# Altium project NeoIVClock.PrjPcb
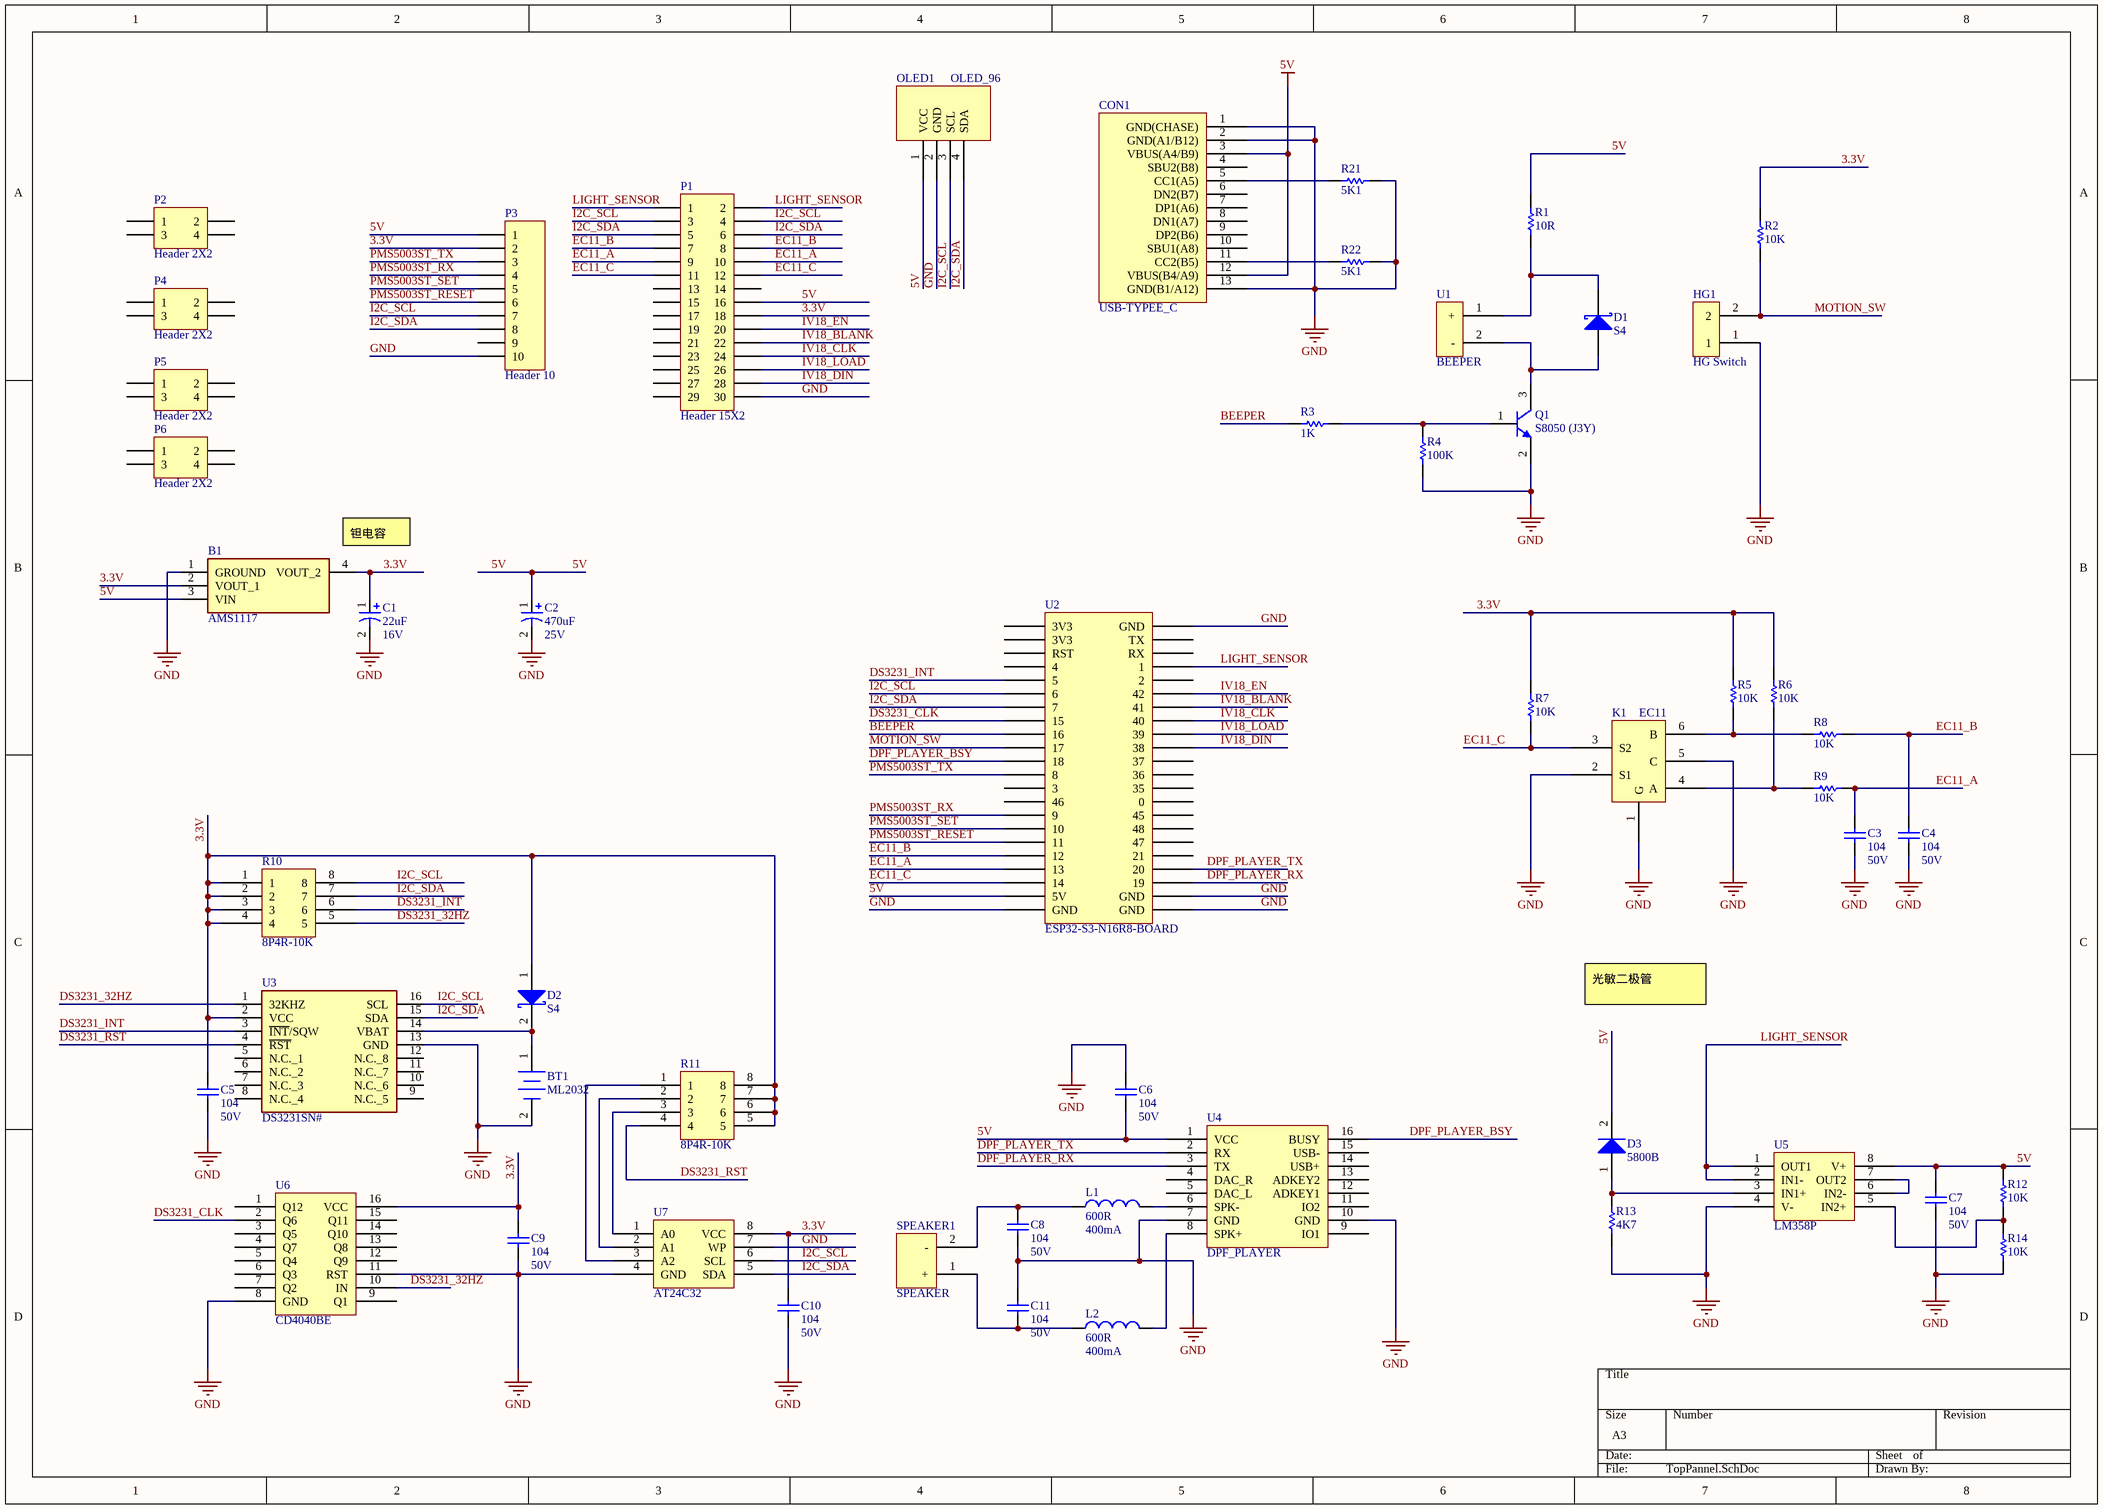
[diagram p0: TopPannel.SchDoc]
3 sheets, 87 parts. Net scope: global (net labels, ports and power ports of the same name join across sheets).
Board file: NeoIVClock.PcbDoc
Sheets:
  TopPannel.SchDoc
  RightPannel.SchDoc
  BottomPanel.SchDoc

## Sheet TopPannel.SchDoc
size A3; SheetNumber: 1; SheetTotal: 3

### Parts
B1  AMS1117  [SOT229P700X180-4N]
BT1  ML2032  [BAT2025-2032-L]
C1  16V  value 22uF  [TC3216-1206]
C2  25V  value 470uF  [SMD-EC-F10]
C3  50V  value 104  [CAPC1608L]
C4  50V  value 104  [CAPC1608L]
C5  50V  value 104  [CAPC1608L]
C6  50V  value 104  [CAPC1608L]
C7  50V  value 104  [CAPC1608L]
C8  50V  value 104  [CAPC1608L]
C9  50V  value 104  [CAPC1608L]
C10  50V  value 104  [CAPC1608L]
C11  50V  value 104  [CAPC1608L]
CON1  USB-TYPEE_C  [USB-TYPE_C]
D1  S4  [CD3216-1206]
D2  S4  [CD3216-1206]
D3  5800B  [5800B]
HG1  HG Switch  [HG]
K1  EC11  [EC11]
L1  400mA  value 600R  [CAPC2012L]
L2  400mA  value 600R  [CAPC2012L]
OLED1  OLED_96  [OLED_96]
P1  Header 15X2  [HDR2X15]
P2  Header 2X2  [HDR2X2]
P3  Header 10  [XH254-W-10P]
P4  Header 2X2  [HDR2X2]
P5  Header 2X2  [HDR2X2]
P6  Header 2X2  [HDR2X2]
Q1  S8050 (J3Y)  [SOT-23B_L]
R1  value 10R  [RESC1608L]  (hidden comment: Res1)
R2  value 10K  [RESC1608L]  (hidden comment: Res1)
R3  value 1K  [RESC1608L]  (hidden comment: Res1)
R4  value 100K  [RESC1608L]  (hidden comment: Res1)
R5  value 10K  [RESC1608L]  (hidden comment: Res1)
R6  value 10K  [RESC1608L]  (hidden comment: Res1)
R7  value 10K  [RESC1608L]  (hidden comment: Res1)
R8  value 10K  [RESC1608L]  (hidden comment: Res1)
R9  value 10K  [RESC1608L]  (hidden comment: Res1)
R10  8P4R-10K  [8P4R 0603]
R11  8P4R-10K  [8P4R 0603]
R12  value 10K  [RESC1608L]  (hidden comment: Res1)
R13  value 4K7  [RESC1608L]  (hidden comment: Res1)
R14  value 10K  [RESC1608L]  (hidden comment: Res1)
R21  value 5K1  [RESC1608L]  (hidden comment: Res1)
R22  value 5K1  [RESC1608L]  (hidden comment: Res1)
SPEAKER1  SPEAKER  [SPEAKER]
U1  BEEPER  [BEEPER]
U2  ESP32-S3-N16R8-BOARD  [ESP32-S3-N16R8-BOARD]
U3  DS3231SN#  [SOIC127P1032X265-16N]
U4  DPF_PLAYER  [DPF_PLAYER]
U5  LM358P  [DIP-8]
U6  CD4040BE  [DIP-16]
U7  AT24C32  [DIP-8]

### Nets
5V: B1.3(VIN) C2.1 C6.1 C7.2 CON1.3(VBUS(A4/B9)) CON1.12(VBUS(B4/A9)) D3.2(K) OLED1.1(VCC) P1.16 P3.1 R1.1 R12.1 U2.21(5V) U4.1(VCC) U5.8(V+)
GND: B1.1(GROUND) BT1.2(-) C1.2 C2.2 C3.1 C4.1 C5.1 C6.2 C7.1 C8.1 C9.1 C10.1 C11.2 CON1.1(GND(CHASE)) CON1.2(GND(A1/B12)) CON1.13(GND(B1/A12)) HG1.1 K1.1(G) K1.2(S1) K1.5(C) OLED1.2(GND) P1.30 P3.10 Q1.2(E) R4.2 R13.2 R14.2 R21.2 R22.2 U2.22(GND) U2.23(GND) U2.24(GND) U2.44(GND) U3.13(GND) U4.7(GND) U4.10(GND) U5.4(V-) U6.8(GND) U6.11(RST) U7.4(GND) U7.7(WP)
3.3V: B1.2(VOUT_1) B1.4(VOUT_2) C1.1 C5.2 C9.2 C10.2 D2.1(A) P1.18 P3.2 R2.1 R5.1 R6.1 R7.1 R10.1 R10.2 R10.3 R10.4 R11.5 R11.6 R11.7 R11.8 U3.2(VCC) U6.16(VCC) U7.8(VCC)
BEEPER: R3.1 U2.9(16)
DPF_PLAYER_BSY: U2.11(18) U4.16(BUSY)
DPF_PLAYER_RX: U2.25(19) U4.3(TX)
DPF_PLAYER_TX: U2.26(20) U4.2(RX)
DS3231_32HZ: R10.5 U3.1(32KHZ) U6.10(IN)
DS3231_CLK: U2.8(15) U6.2(Q6)
DS3231_INT: R10.6 U2.5 U3.3(~{INT}/SQW)
DS3231_RST: R11.4 U3.4(~{RST})
EC11_A: C3.2 P1.9 P1.10 R9.2 U2.19(13)
EC11_B: C4.2 P1.7 P1.8 R8.2 U2.18(12)
EC11_C: K1.3(S2) P1.11 P1.12 R7.2 U2.20(14)
I2C_SCL: OLED1.3(SCL) P1.3 P1.4 P3.7 R10.8 U2.6 U3.16(SCL) U7.6(SCL)
I2C_SDA: OLED1.4(SDA) P1.5 P1.6 P3.8 R10.7 U2.7 U3.15(SDA) U7.5(SDA)
IV18_BLANK: P1.22 U2.38(41)
IV18_CLK: P1.24 U2.37(40)
IV18_DIN: P1.28 U2.35(38)
IV18_EN: P1.20 U2.39(42)
IV18_LOAD: P1.26 U2.36(39)
LIGHT_SENSOR: P1.1 P1.2 U2.41(1) U5.1(OUT1) U5.2(IN1-)
MOTION_SW: HG1.2 R2.2 U2.10(17)
PMS5003ST_RESET: P3.6 U2.17(11)
PMS5003ST_RX: P3.4 U2.15(9)
PMS5003ST_SET: P3.5 U2.16(10)
PMS5003ST_TX: P3.3 U2.12(8)
NetBT1_1: BT1.1(+) D2.2(K) U3.14(VBAT)
NetC8_2: C8.2 L1.1 SPEAKER1.2(-)
NetC11_1: C11.1 L2.1 SPEAKER1.1(+)
NetCON1_5: CON1.5(CC1(A5)) R21.1
NetCON1_11: CON1.11(CC2(B5)) R22.1
NetD1_1: D1.1(A) Q1.3(C) U1.2(-)
NetD1_2: D1.2(K) R1.2 U1.1(+)
NetD3_1: D3.1(A) R13.1 U5.3(IN1+)
NetK1_4: K1.4(A) R6.2 R9.1
NetK1_6: K1.6(B) R5.2 R8.1
NetL1_2: L1.2 U4.6(SPK-)
NetL2_2: L2.2 U4.8(SPK+)
NetQ1_1: Q1.1(B) R3.2 R4.1
NetR11_1: R11.1 U7.3(A2)
NetR11_2: R11.2 U7.2(A1)
NetR11_3: R11.3 U7.1(A0)
NetR12_2: R12.2 R14.1 U5.5(IN2+)
NetU5_6: U5.6(IN2-) U5.7(OUT2)

Not connected (* = marked no-connect by the designer): CON1 4(SBU2(B8)) 6(DN2(B7)) 7(DP1(A6)) 8(DN1(A7)) 9(DP2(B6)) 10(SBU1(A8)); P1 13 14 15 17 19 21 23 25 27 29; P2 1 2 3 4; P3 9; P4 1 2 3 4; P5 1 2 3 4; P6 1 2 3 4; U2 1(3V3) 2(3V3) 3(RST) 4 13(3) 14(46) 27(21) 28(47) 29(48) 30(45) 31(0) 32(35) 33(36) 34(37) 40(2) 42(RX) 43(TX); U3 5(N.C._1) 6(N.C._2) 7(N.C._3) 8(N.C._4) 9(N.C._5) 10(N.C._6) 11(N.C._7) 12(N.C._8); U4 4(DAC_R) 5(DAC_L) 9(IO1) 11(IO2) 12(ADKEY1) 13(ADKEY2) 14(USB+) 15(USB-); U6 1(Q12) 3(Q5) 4(Q7) 5(Q4) 6(Q3) 7(Q2) 9(Q1) 12(Q9) 13(Q8) 14(Q10) 15(Q11)

### Notes on the sheet
- (near B1) 钽电容
- 光敏二极管

### Library data of the parts
B1 = AMS1117: 1117; Manufacturer_Name: Advanced Monolithic Systems; Geometry.Height: 1.8mm; Manufacturer_Part_Number: AMS1117; Mouser Part Number: *; Mouser Price/Stock: *; Arrow Part Number: *; Arrow Price/Stock: *; Datasheet Link: https://datasheet.lcsc.com/szlcsc/Advanced-Monolithic-Systems-AMS-AMS1117-ADJ_C6188.pdf
BT1 = Battery: Multicell Battery; Published: 24-Mar-1999; LatestRevisionDate: 17-Jul-2002; LatestRevisionNote: Re-released for DXP Platform.; PackageReference: BAT-2; Publisher: Altium Limited; PackageDescription: Battery; 2 Leads
C1 C2 = Cap Pol1: Polarized Capacitor (Radial); Published: 8-Jun-2000; LatestRevisionDate: 17-Jul-2002; LatestRevisionNote: Re-released for DXP Platform.; PackageReference: RB7.6-15; Publisher: Altium Limited; PackageDescription: Polarized Capacitor (Radial); 2 Leads
C3-C11 = Cap: Capacitor; Published: 8-Jun-2000; LatestRevisionDate: 17-Jul-2002; LatestRevisionNote: Re-released for DXP Platform.; PackageReference: RAD-0.3; Publisher: Altium Limited; PackageDescription: Radial Cap, Thru-Hole; 2 Leads; 0.3 in Pin Spacing
D1 D2 = D Schottky: Schottky Diode; Published: 8-Jun-2000; LatestRevisionDate: 17-Jul-2002; LatestRevisionNote: Re-released for DXP Platform.; PackageReference: SMB; Publisher: Altium Limited; PackageDescription: DO-214-AA/SMB; 2 C-Bend Leads; Body 5.3 x 3.6 mm, inc. leads (LxW); Code_JEDEC: DO-214-AA
D3 = Diode: Default Diode; Published: 8-Jun-2000; LatestRevisionDate: 17-Jul-2002; LatestRevisionNote: Re-released for DXP Platform.; PackageVersion: Sep-1996; PackageReference: SMC; Publisher: Altium Limited; PackageDescription: DO-214-AB/SMC; 2 C-Bend Leads; Body 7.9 x 5.9 mm, inc. leads (LxW); Code_JEDEC: DO-214-AB
HG1 = HG
L1 L2 = Inductor: Code_IEC: 1005; Published: 8-Jun-2000; LatestRevisionDate: 29-May-2009; LatestRevisionNote: IPC-7351 Footprint Added.; PackageReference: 0402-A; Publisher: Altium Limited; PackageDescription: Chip Inductor; Code_JEITA: 0402
P1 = Header 15X2: Header, 15-Pin, Dual row; LatestRevisionDate: 17-Jul-2002; LatestRevisionNote: Re-released for DXP Platform.; Publisher: Altium Limited
P2 P4-P6 = Header 2X2: Header, 2-Pin, Dual row; LatestRevisionDate: 17-Jul-2002; LatestRevisionNote: Re-released for DXP Platform.; Publisher: Altium Limited
P3 = Header 10: Header, 10-Pin; LatestRevisionDate: 17-Jul-2002; LatestRevisionNote: Re-released for DXP Platform.; Publisher: Altium Limited
Q1 = NPN: NPN Bipolar Transistor; Published: 8-Jun-2000; LatestRevisionDate: 17-Jul-2002; LatestRevisionNote: Re-released for DXP Platform.; PackageReference: TO-226-AA; Publisher: Altium Limited; PackageDescription: TO, Flat Index; 3 In-Line, Axial Leads; Body Dia. 4.8mm; Leads 0.55 x 0.51 mm (max); Code_JEDEC: TO-226-AA
R1-R9 R12-R14 R21 R22 = Res1: Resistor; Published: 8-Jun-2000; LatestRevisionDate: 17-Jul-2002; LatestRevisionNote: Re-released for DXP Platform.; PackageReference: AXIAL-0.3; Publisher: Altium Limited; PackageDescription: Axial Device, Thru-Hole; 2 Leads; 0.3 in Pin Spacing
R10 R11 = 8P4R
U3 = DS3231SN#: Real Time Clock Serial Maxim DS3231SN# Real Time Clock, Battery Backup, Calendar, Clock, I2C, 5.5 V, 16-Pin SOIC; Manufacturer_Name: Analog Devices; Geometry.Height: 2.65mm; Manufacturer_Part_Number: DS3231SN#; Mouser Part Number: 700-DS3231SN#; Mouser Price/Stock: https://www.mouser.co.uk/ProductDetail/Analog-Devices-Maxim-Integrated/DS3231SN?qs=1eQvB6Dk1vhUlr8%2FOrV0Fw%3D%3D; Arrow Part Number: DS3231SN#; Arrow Price/Stock: https://www.arrow.com/en/products/ds3231sn_2/analog-devices.html?utm_currency=USD&region=nac; Datasheet Link: https://datasheets.maximintegrated.com/en/ds/DS3231.pdf

## Sheet RightPannel.SchDoc
size A4; SheetNumber: 2; SheetTotal: 3
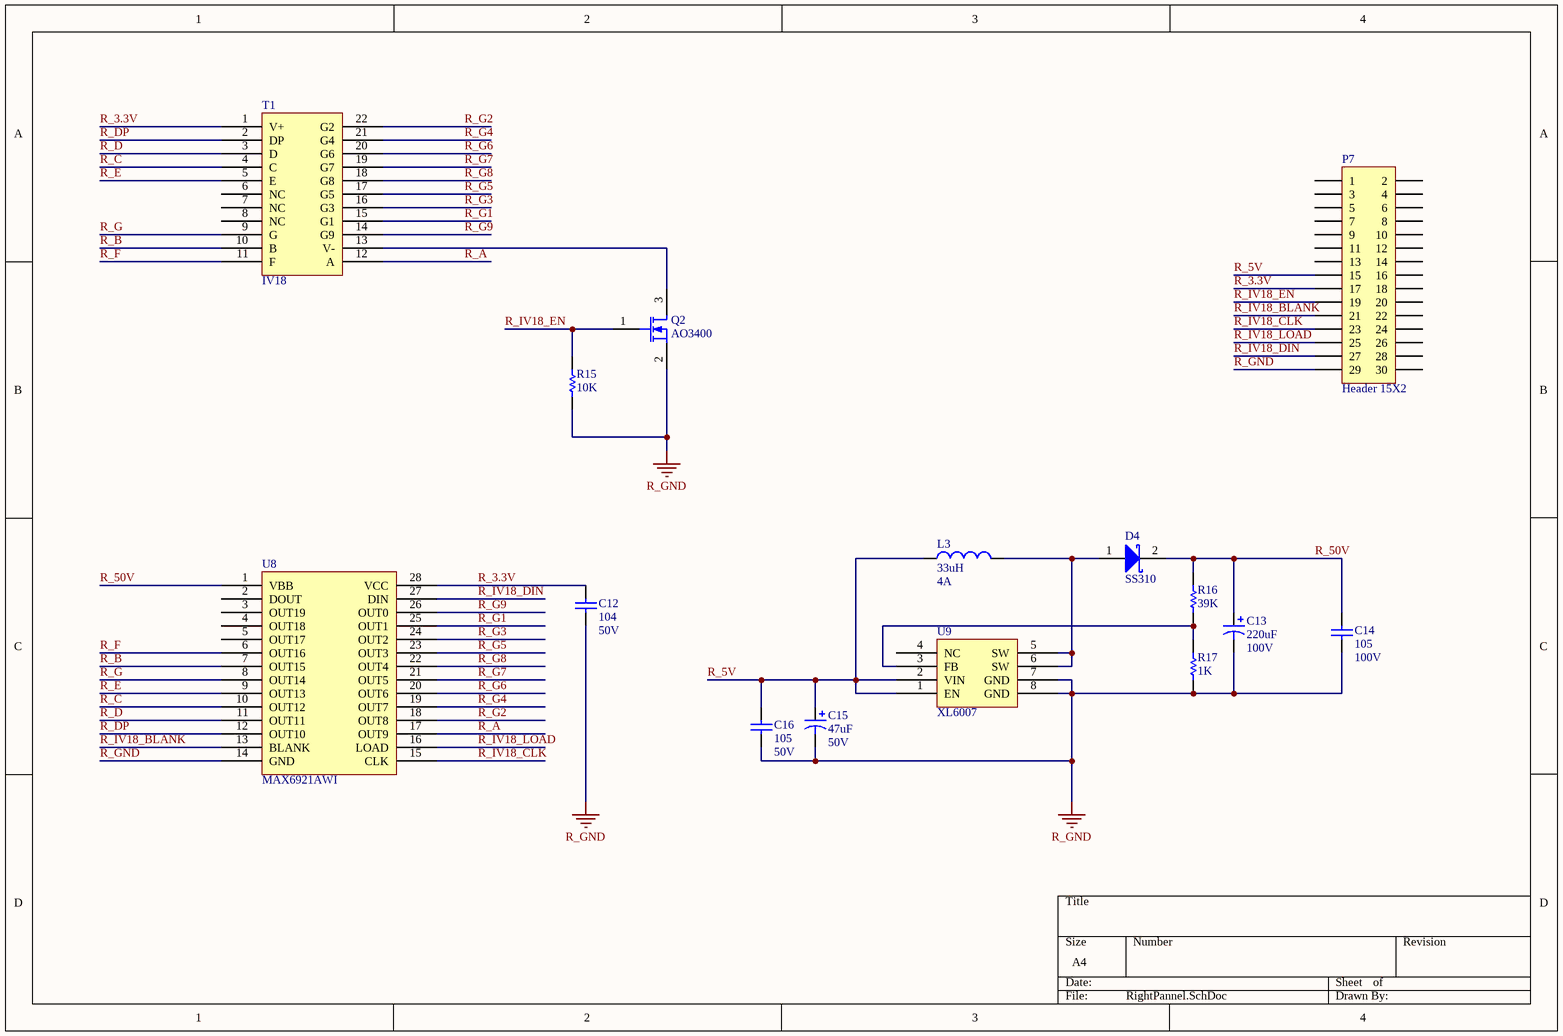
[diagram p1: RightPannel.SchDoc]

### Parts
C12  50V  value 104  [CAPC1608L]
C13  100V  value 220uF  [SMD-EC-F16]
C14  100V  value 105  [CAPC2012L]
C15  50V  value 47uF  [SMD-EC-F6.3]
C16  50V  value 105  [CAPC1608L]
D4  SS310  [DO-214AC-SMA]
L3  4A  value 33uH  [CYH125]
P7  Header 15X2  [HDR2X15]
Q2  AO3400  [SOT-23B_L]
R15  value 10K  [RESC1608L]  (hidden comment: Res1)
R16  value 39K  [RESC1608L]  (hidden comment: Res1)
R17  value 1K  [RESC1608L]  (hidden comment: Res1)
T1  IV18  [IV18]
U8  MAX6921AWI  [SOIC127P1032X265-28N]
U9  XL6007  [SOP127P780-8L]

### Nets
R_GND: C12.1 C13.2 C14.1 C15.2 C16.1 P7.29 Q2.2(S) R15.2 R17.2 U8.14(GND) U9.7(GND) U9.8(GND)
R_3.3V: C12.2 P7.17 T1.1(V+) U8.28(VCC)
R_5V: C15.1 C16.2 L3.1 P7.15 U9.1(EN) U9.2(VIN)
R_50V: C13.1 C14.2 D4.2(K) R16.1 U8.1(VBB)
R_A: T1.12(A) U8.17(OUT9)
R_B: T1.10(B) U8.7(OUT15)
R_C: T1.4(C) U8.10(OUT12)
R_D: T1.3(D) U8.11(OUT11)
R_DP: T1.2(DP) U8.12(OUT10)
R_E: T1.5(E) U8.9(OUT13)
R_F: T1.11(F) U8.6(OUT16)
R_G: T1.9(G) U8.8(OUT14)
R_G1: T1.15(G1) U8.25(OUT1)
R_G2: T1.22(G2) U8.18(OUT8)
R_G3: T1.16(G3) U8.24(OUT2)
R_G4: T1.21(G4) U8.19(OUT7)
R_G5: T1.17(G5) U8.23(OUT3)
R_G6: T1.20(G6) U8.20(OUT6)
R_G7: T1.19(G7) U8.21(OUT5)
R_G8: T1.18(G8) U8.22(OUT4)
R_G9: T1.14(G9) U8.26(OUT0)
R_IV18_BLANK: P7.21 U8.13(BLANK)
R_IV18_CLK: P7.23 U8.15(CLK)
R_IV18_DIN: P7.27 U8.27(DIN)
R_IV18_EN: P7.19 Q2.1(G) R15.1
R_IV18_LOAD: P7.25 U8.16(LOAD)
NetD4_1: D4.1(A) L3.2 U9.5(SW) U9.6(SW)
NetQ2_3: Q2.3(D) T1.13(V-)
NetR16_2: R16.2 R17.1 U9.3(FB)

Not connected (* = marked no-connect by the designer): P7 1 2 3 4 5 6 7 8 9 10 11 12 13 14 16 18 20 22 24 26 28 30; T1 6(NC) 7(NC) 8(NC); U8 2(DOUT) 3(OUT19) 4(OUT18) 5(OUT17); U9 4(NC)

### Library data of the parts
C12 C14 C16 = Cap: Capacitor; Published: 8-Jun-2000; LatestRevisionDate: 17-Jul-2002; LatestRevisionNote: Re-released for DXP Platform.; PackageReference: RAD-0.3; Publisher: Altium Limited; PackageDescription: Radial Cap, Thru-Hole; 2 Leads; 0.3 in Pin Spacing
C13 C15 = Cap Pol1: Polarized Capacitor (Radial); Published: 8-Jun-2000; LatestRevisionDate: 17-Jul-2002; LatestRevisionNote: Re-released for DXP Platform.; PackageReference: RB7.6-15; Publisher: Altium Limited; PackageDescription: Polarized Capacitor (Radial); 2 Leads
D4 = D Schottky: Schottky Diode; Published: 8-Jun-2000; LatestRevisionDate: 17-Jul-2002; LatestRevisionNote: Re-released for DXP Platform.; PackageReference: SMB; Publisher: Altium Limited; PackageDescription: DO-214-AA/SMB; 2 C-Bend Leads; Body 5.3 x 3.6 mm, inc. leads (LxW); Code_JEDEC: DO-214-AA
L3 = Inductor: Code_IEC: 1005; Published: 8-Jun-2000; LatestRevisionDate: 29-May-2009; LatestRevisionNote: IPC-7351 Footprint Added.; PackageReference: 0402-A; Publisher: Altium Limited; PackageDescription: Chip Inductor; Code_JEITA: 0402
P7 = Header 15X2: Header, 15-Pin, Dual row; LatestRevisionDate: 17-Jul-2002; LatestRevisionNote: Re-released for DXP Platform.; Publisher: Altium Limited
Q2 = MOSFET-N: N-Channel MOSFET; Published: 8-Jun-2000; LatestRevisionDate: 17-Jul-2002; LatestRevisionNote: Re-released for DXP Platform.; PackageVersion: 1995/1996; PackageReference: E3; Publisher: Altium Limited; PackageDescription: TO, Flat Index; 3 In-Line, Axial Leads; Body Dia. 4.6mm; Lead Dia. 0.5 mm (max)
R15-R17 = Res1: Resistor; Published: 8-Jun-2000; LatestRevisionDate: 17-Jul-2002; LatestRevisionNote: Re-released for DXP Platform.; PackageReference: AXIAL-0.3; Publisher: Altium Limited; PackageDescription: Axial Device, Thru-Hole; 2 Leads; 0.3 in Pin Spacing

## Sheet BottomPanel.SchDoc
size A3; SheetNumber: 3; SheetTotal: 3
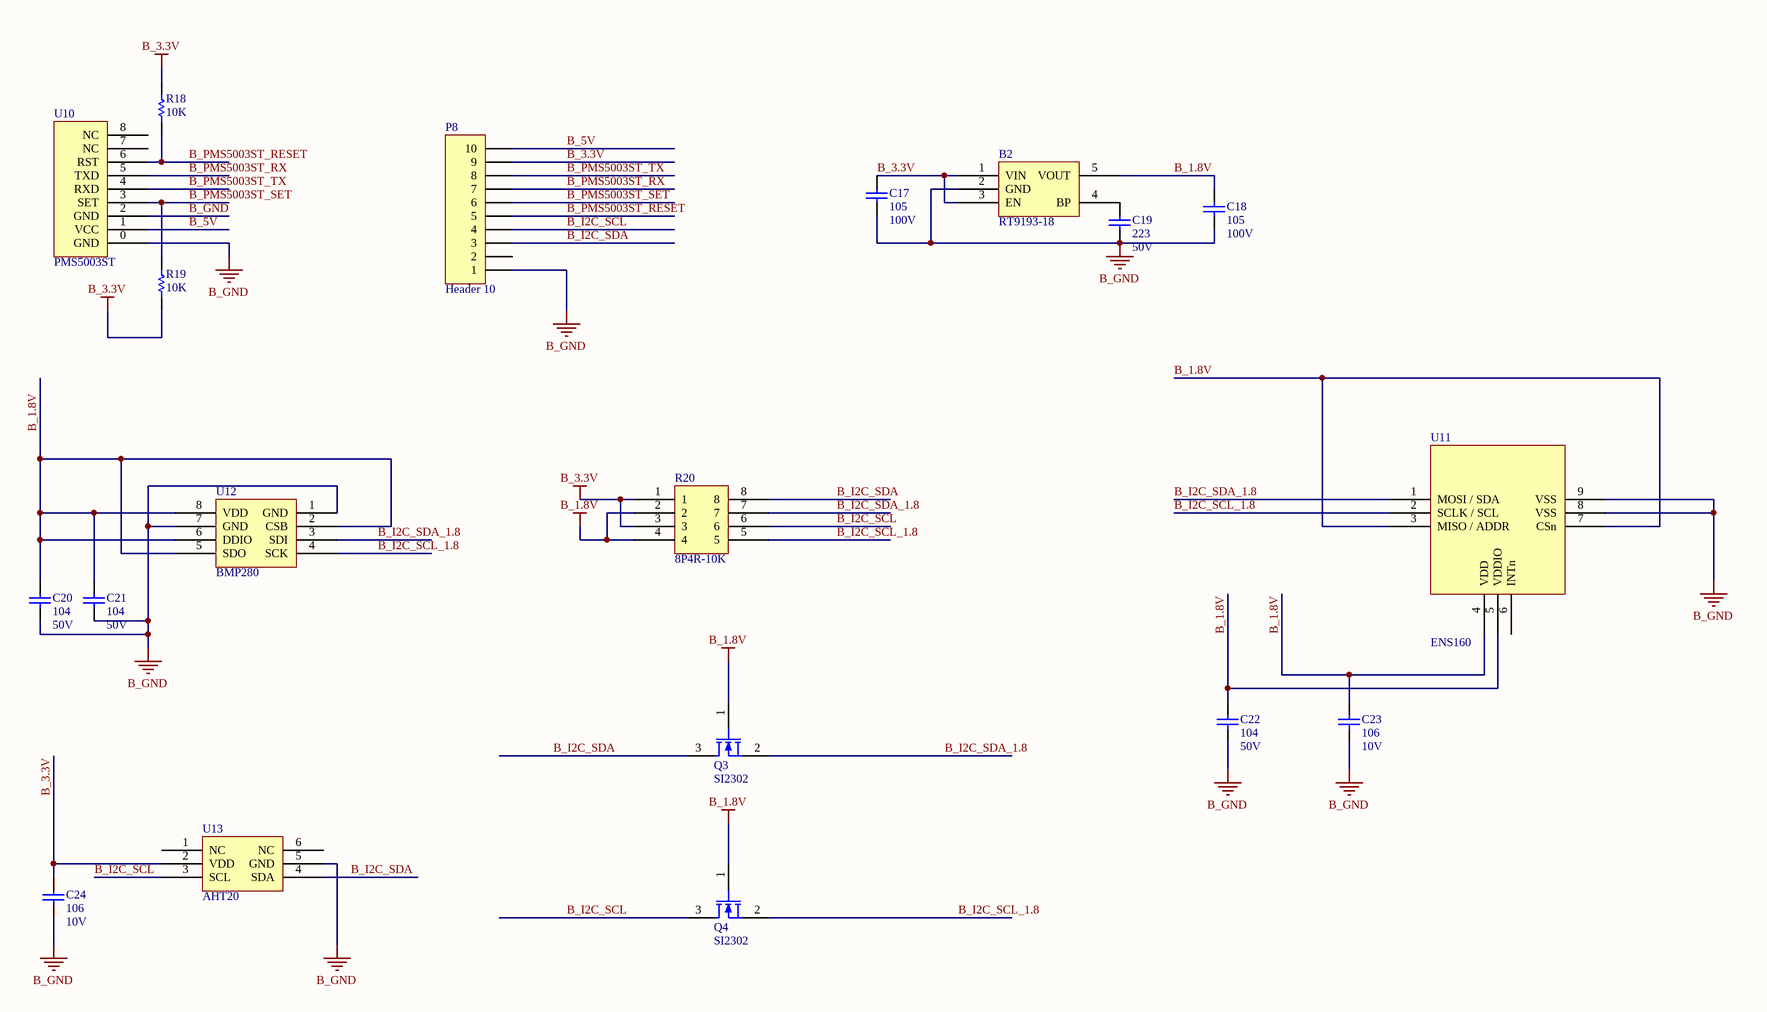
[diagram p2: BottomPanel.SchDoc]

### Parts
B2  RT9193-18  [SOT23-5AL]
C17  100V  value 105  [CAPC2012L]
C18  100V  value 105  [CAPC2012L]
C19  50V  value 223  [CAPC1608L]
C20  50V  value 104  [CAPC1608L]
C21  50V  value 104  [CAPC1608L]
C22  50V  value 104  [CAPC1608L]
C23  10V  value 106  [CAPC1608L]
C24  10V  value 106  [CAPC1608L]
P8  Header 10  [XH254-W-10P]
Q3  SI2302  [SOT-23B_L]
Q4  SI2302  [SOT-23B_L]
R18  value 10K  [RESC1608L]  (hidden comment: Res1)
R19  value 10K  [RESC1608L]  (hidden comment: Res1)
R20  8P4R-10K  [8P4R 0603]
U10  PMS5003ST  [PMS5003ST]
U11  ENS160  [ENS160]
U12  BMP280  [BMP280]
U13  AHT20  [AHT20]

### Nets
B_1.8V: B2.5(VOUT) C18.2 C20.2 C21.2 C22.2 C23.2 Q3.1(G) Q4.1(G) R20.2 R20.4 U11.3(MISO_/_ADDR) U11.4(VDD) U11.5(VDDIO) U11.7(CSn) U12.2(CSB) U12.5(SDO) U12.6(DDIO) U12.8(VDD)
B_3.3V: B2.1(VIN) B2.3(EN) C17.2 C24.2 P8.9 R18.1 R19.2 R20.1 R20.3 U13.2(VDD)
B_GND: B2.2(GND) C17.1 C18.1 C19.1 C20.1 C21.1 C22.1 C23.1 C24.1 P8.1 U10.0(GND) U10.2(GND) U11.8(VSS) U11.9(VSS) U12.1(GND) U12.7(GND) U13.5(GND)
B_5V: P8.10 U10.1(VCC)
B_I2C_SCL: P8.4 Q4.3(D) R20.6 U13.3(SCL)
B_I2C_SCL_1.8: Q4.2(S) R20.5 U11.2(SCLK_/_SCL) U12.4(SCK)
B_I2C_SDA: P8.3 Q3.3(D) R20.8 U13.4(SDA)
B_I2C_SDA_1.8: Q3.2(S) R20.7 U11.1(MOSI_/_SDA) U12.3(SDI)
B_PMS5003ST_RESET: P8.5 R18.2 U10.6(RST)
B_PMS5003ST_RX: P8.7 U10.5(TXD)
B_PMS5003ST_SET: P8.6 R19.1 U10.3(SET)
B_PMS5003ST_TX: P8.8 U10.4(RXD)
NetB2_4: B2.4(BP) C19.2

Not connected (* = marked no-connect by the designer): P8 2; U10 7(NC) 8(NC); U11 6(INTn); U13 1(NC) 6(NC)

### Library data of the parts
C17-C24 = Cap: Capacitor; Published: 8-Jun-2000; LatestRevisionDate: 17-Jul-2002; LatestRevisionNote: Re-released for DXP Platform.; PackageReference: RAD-0.3; Publisher: Altium Limited; PackageDescription: Radial Cap, Thru-Hole; 2 Leads; 0.3 in Pin Spacing
P8 = Header 10: Header, 10-Pin; LatestRevisionDate: 17-Jul-2002; LatestRevisionNote: Re-released for DXP Platform.; Publisher: Altium Limited
Q3 Q4 = MOSFET-N: N-Channel MOSFET; Published: 8-Jun-2000; LatestRevisionDate: 17-Jul-2002; LatestRevisionNote: Re-released for DXP Platform.; PackageVersion: 1995/1996; PackageReference: E3; Publisher: Altium Limited; PackageDescription: TO, Flat Index; 3 In-Line, Axial Leads; Body Dia. 4.6mm; Lead Dia. 0.5 mm (max)
R18 R19 = Res1: Resistor; Published: 8-Jun-2000; LatestRevisionDate: 17-Jul-2002; LatestRevisionNote: Re-released for DXP Platform.; PackageReference: AXIAL-0.3; Publisher: Altium Limited; PackageDescription: Axial Device, Thru-Hole; 2 Leads; 0.3 in Pin Spacing
R20 = 8P4R